# Altium schematic sheet Sheet1.SchDoc
size A
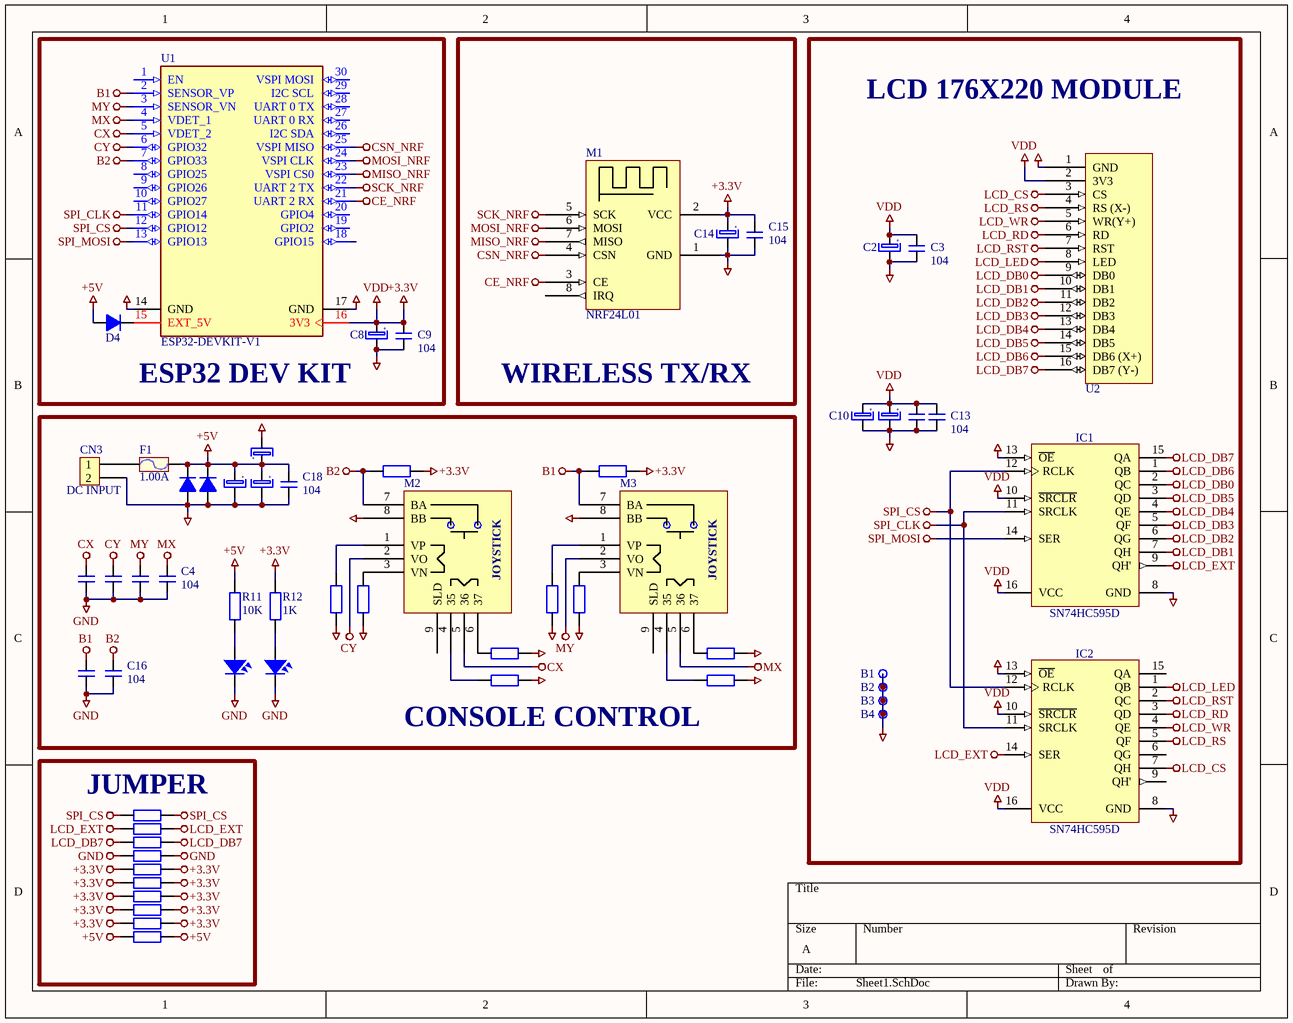
[diagram p0: Sheet1.SchDoc]

## Parts
B1  Plated Hole  [MTG300_600]  (value not drawn)
B2  Plated Hole  [MTG300_600]  (value not drawn)
B3  Plated Hole  [MTG300_600]  (value not drawn)
B4  Plated Hole  [MTG300_600]  (value not drawn)
C1  470uF  [Cap-P-2.5/6.3]  (value not drawn)
C2  220uF  [Cap-P-2.5/5]  (value not drawn)
C3  104  [Cap-Non-150mil]
C4  104  [CAP-SMD-0805]
C5  104  [CAP-SMD-0805]  (value not drawn)
C6  104  [CAP-SMD-0805]  (value not drawn)
C7  104  [CAP-SMD-0805]  (value not drawn)
C8  220uF  [Cap-P-2.5/5]  (value not drawn)
C9  104  [Cap-Non-150mil]
C10  220uF  [Cap-P-2.5/5]  (value not drawn)
C11  220uF  [Cap-P-2.5/5]  (value not drawn)
C12  104  [Cap-Non-150mil]  (value not drawn)
C13  104  [Cap-Non-150mil]
C14  220uF  [Cap-P-2.5/5]  (value not drawn)
C15  104  [Cap-Non-150mil]
C16  104  [CAP-SMD-0805]
C17  104  [CAP-SMD-0805]  (value not drawn)
C18  104  [Cap-Non-150mil]
C19  470uF  [Cap-P-2.5/6.3]  (value not drawn)
C20  470uF  [Cap-P-2.5/6.3]  (value not drawn)
CN3  DC INPUT  [KF2/5.08]
D1  SS14  [SOD 106]  (value not drawn)
D2  SS14  [SOD 106]  (value not drawn)
D4  SS14  [SOD 106]  (value not drawn)
F1  1.00A  [Fuse-Dip1]
IC1  SN74HC595D  [SOIC127P600X175-16N]
IC2  SN74HC595D  [SOIC127P600X175-16N]
LED1  POWER  [LED-0805]  (value not drawn)
LED2  ESP-3.3V  [LED-0805]  (value not drawn)
M1  NRF24L01  [NRF24L01P_M]
M2  JOYSTICK  [JOYSTICK]  (value not drawn)
M3  JOYSTICK  [JOYSTICK]  (value not drawn)
R1  1K  [RES-SMD-0805]  (value not drawn)
R2  1K  [RES-SMD-0805]  (value not drawn)
R3  1K  [RES-SMD-0805]  (value not drawn)
R4  1K  [RES-SMD-0805]  (value not drawn)
R5  1K  [RES-SMD-0805]  (value not drawn)
R6  1K  [RES-SMD-0805]  (value not drawn)
R7  1K  [RES-SMD-0805]  (value not drawn)
R8  1K  [RES-SMD-0805]  (value not drawn)
R9  1K  [RES-SMD-0805]  (value not drawn)
R10  1K  [RES-SMD-0805]  (value not drawn)
R11  10K  [RES-SMD-0805]
R12  1K  [RES-SMD-0805]
R13  0R  [RES-SMD-0805]  (value not drawn)
R14  0R  [RES-SMD-0805]  (value not drawn)
R15  0R  [RES-SMD-0805]  (value not drawn)
R16  0R  [RES-SMD-1206]  (value not drawn)
R17  0R  [RES-SMD-1206]  (value not drawn)
R18  0R  [RES-SMD-1206]  (value not drawn)
R19  0R  [RES-SMD-2512]  (value not drawn)
R20  0R  [RES-SMD-2512]  (value not drawn)
R21  0R  [RES-SMD-2512]  (value not drawn)
R22  0R  [RES-SMD-2512]  (value not drawn)
U1  ESP32-DEVKIT-V1  [MODULE_ESP32-DEVKITC-32D]
U2  ST7775R_2.0  [LCD_176X220_MODULE]  (value not drawn)

## Blocks framed on the sheet
ESP32 DEV KIT: C8 C9 D4 U1
WIRELESS TX/RX: C14 C15 M1
LCD 176X220 MODULE: B1-B4 C2 C3 C10-C13 IC1 IC2 U2
CONSOLE CONTROL: C1 C4-C7 C16-C20 CN3 D1 D2 F1 LED1 LED2 M2 M3 R1-R12
JUMPER: R13-R22

## Nets
+3.3V: C2.1 C3.2 C8.1 C9.2 C10.1 C11.1 C12.2 C13.2 C14.1 C15.2 IC1.10(~{SRCLR}) IC1.16(VCC) IC2.10(~{SRCLR}) IC2.16(VCC) M1.2(VCC) R1.2 R2.2 R4.1 R6.1 R7.1 R8.1 R12.2 R17.1 R17.2 R18.1 R18.2 R19.1 R19.2 R20.1 R20.2 R21.1 R21.2 U1.16(3V3) U2.2(3V3)  [also labelled VDD]
+5V: C1.1 C18.2 C19.1 C20.1 D1.2(K) D2.2(K) D4.1(A) F1.2 R11.2 R22.1 R22.2
B1: C17.2 M3.7(BA) R2.1 U1.2(SENSOR_VP)
B2: C16.2 M2.7(BA) R1.1 U1.7(GPIO33)
CE_NRF: M1.3(CE) U1.21(UART_2_RX)
CSN_NRF: M1.4(CSN) U1.25(VSPI_MISO)
CX: C5.2 M2.5(36) U1.5(VDET_2)
CY: C6.2 M2.2(VO) U1.6(GPIO32)
GND: B1.1 B2.1 B3.1 B4.1 C1.2 C2.2 C3.1 C4.1 C5.1 C6.1 C7.1 C8.2 C9.1 C10.2 C11.2 C12.1 C13.1 C14.2 C15.1 C16.1 C17.1 C18.1 C19.2 C20.2 CN3.2 D1.1(A) D2.1(A) IC1.8(GND) IC1.13(~{OE}) IC2.8(GND) IC2.13(~{OE}) LED1.2 LED2.2 M1.1(GND) M2.8(BB) M3.8(BB) R3.1 R5.1 R9.1 R10.1 R16.1 R16.2 U1.14(GND) U1.17(GND) U2.1(GND)
LCD_CS: IC2.7(QH) U2.3(CS)
LCD_DB0: IC1.2(QC) U2.9(DB0)
LCD_DB1: IC1.7(QH) U2.10(DB1)
LCD_DB2: IC1.6(QG) U2.11(DB2)
LCD_DB3: IC1.5(QF) U2.12(DB3)
LCD_DB4: IC1.4(QE) U2.13(DB4)
LCD_DB5: IC1.3(QD) U2.14(DB5)
LCD_DB6: IC1.1(QB) U2.15(DB6_(X+))
LCD_DB7: IC1.15(QA) R15.1 R15.2 U2.16(DB7_(Y-))
LCD_EXT: IC1.9(QH') IC2.14(SER) R14.1 R14.2
LCD_LED: IC2.1(QB) U2.8(LED)
LCD_RD: IC2.3(QD) U2.6(RD)
LCD_RS: IC2.5(QF) U2.4(RS_(X-))
LCD_RST: IC2.2(QC) U2.7(RST)
LCD_WR: IC2.4(QE) U2.5(WR(Y+))
MISO_NRF: M1.7(MISO) U1.23(VSPI_CS0)
MOSI_NRF: M1.6(MOSI) U1.24(VSPI_CLK)
MX: C4.2 M3.5(36) U1.4(VDET_1)
MY: C7.2 M3.2(VO) U1.3(SENSOR_VN)
SCK_NRF: M1.5(SCK) U1.22(UART_2_TX)
SPI_CLK: IC1.11(SRCLK) IC2.11(SRCLK) U1.11(GPIO14)
SPI_CS: IC1.12(RCLK) IC2.12(RCLK) R13.1 R13.2 U1.12(GPIO12)
SPI_MOSI: IC1.14(SER) U1.13(GPIO13)
NetCN3_1: CN3.1 F1.1
NetD4_2: D4.2(K) U1.15(EXT_5V)
NetLED1_1: LED1.1 R11.1
NetLED2_1: LED2.1 R12.1
NetM2_1: M2.1(VP) R3.2
NetM2_3: M2.3(VN) R4.2
NetM2_4: M2.4(35) R9.2
NetM2_6: M2.6(37) R7.2
NetM3_1: M3.1(VP) R5.2
NetM3_3: M3.3(VN) R6.2
NetM3_4: M3.4(35) R10.2
NetM3_6: M3.6(37) R8.2

Not connected (* = marked no-connect by the designer): IC2 6(QG) 9(QH') 15(QA); M1 8(IRQ); M2 9(SLD); M3 9(SLD); U1 1(EN) 8(GPIO25) 9(GPIO26) 10(GPIO27) 18(GPIO15) 19(GPIO2) 20(GPIO4) 26(I2C_SDA) 27(UART_0_RX) 28(UART_0_TX) 29(I2C_SCL) 30(VSPI_MOSI)

## Notes on the sheet
- (in symbol Cap-Pol-Dip) +

## Library data of the parts
B1-B4 = PLATED_HOLE3.0_PAD6.0: Single Terminal Socket; Part Description: Plated Through Hole: Hole Dia.=3.0mm Pad Dia.=6.0mm; Mounted: No; Part Number: PLATED_HOLE3.0_PAD6.0; Component Kind: Standard (No BOM); Component Type: Standard (No BOM); Pin Count: 1; Family: Plated Hole; Socket: No; SMD: No; Sense: No; Status: None; ComponentHeight: 0mm; HelpURL: Undefined; Author: CERN DEM JLC; CreateDate: 5/26/2008; LatestRevisionDate: 5/26/2008; PackageDescription: Plated Through Hole: Hole Dia.=3.0mm Pad Dia.=6.0mm
C1 C2 C8 C10 C11 C14 C19 C20 = Cap-Pol-Dip: Polarized capacitor
C3 C9 C12 C13 C15 C18 = Cap-Non-Dip: Non-polar capacitor
C4-C7 C16 C17 = Cap-Non-SMD: Non-polar capacitor
CN3 = KF 2
D1 D2 D4 = Diode SMD
F1 = Fuse Dip
IC1 IC2 = SN74HC595D: 8-Bit Shift Register With 3-State Output Register; Part Description: 8-Bit Shift Register With 3-State Output Registers; Manufacturer: TEXAS INSTRUMENTS; PressFit: No; Bonding: No; Part Number: SN74HC595D; Component Kind: Standard; Component Type: Standard; Device: SN74HC595D; PackageDescription: SOIC 16, Pitch 1.27mm - Body 4x10mm, IPC Medium Density; Manufacturer Part Number: SN74HC595D; Pin Count: 16; Case: SOIC16; Mounted: Yes; Socket: No; SMD: Yes; Sense: No; ComponentHeight: 1.75mm; Author: CERN DEM JLC; HelpURL: \\cern.ch\dfs\Applications\Altium\Datasheets\SN74HC595D.pdf; CreateDate: 6/5/2012; LatestRevisionDate: 6/5/2012
LED1 LED2 = LED_SMD
R1-R22 = Res SMD: Resistor SMD
U1 = ESP32-DEVKIT-V1: - Transceiver; 802.11 b/g/n _Wi-Fi, WiFi, WLAN_, Bluetooth® Smart Ready 4.x Dual Mode For Use With ESP-WROOM-32; MF: Espressif Systems; MP: ESP32-DEVKITC-32D; Package: None; Price: None; Availability: Unavailable; SnapEDA_Link: https://www.snapeda.com/parts/ESP32-DEVKITC-32D/Espressif%20Systems/view-part/2777395/?ref=snap; Value: *
U2 = LCD_176x220_ST7775R: ComponentLink1Description: Wiki; ComponentLink1URL: http://www.lcdwiki.com/2.8inch_SPI_Module_ILI9341_SKU:MSP2807